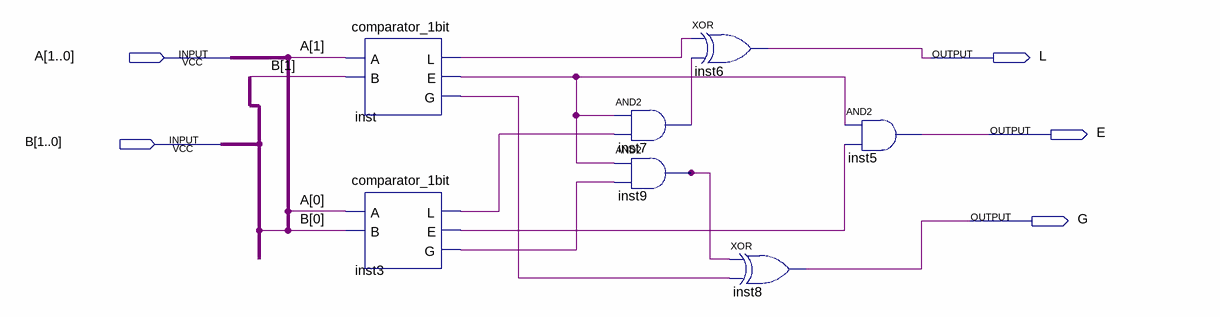
[diagram p0: schematic sheet]
// Quartus schematic comparator_2bit.bdf as structural Verilog: 7 symbols, 5 pins
module comparator_2bit (
  input  [1:0] A,
  input  [1:0] B,
  output L,
  output E,
  output G
);

  wire inst3_e, inst3_g, inst3_l, inst7_out, inst9_out, inst_e, inst_g, inst_l;

  comparator_1bit inst (.A(A[1]), .B(B[1]), .L(inst_l), .E(inst_e), .G(inst_g));
  comparator_1bit inst3 (.A(A[0]), .B(B[0]), .L(inst3_l), .E(inst3_e), .G(inst3_g));
  and inst7 (inst7_out, inst_e, inst3_l);
  and inst9 (inst9_out, inst_e, inst3_g);
  xor inst6 (L, inst_l, inst7_out);
  xor inst8 (G, inst9_out, inst_g);
  and inst5 (E, inst_e, inst3_e);
endmodule
